# EAGLE schematic F5529LP_node (EAGLE 7.2.0)

## Sheet 1 of 2
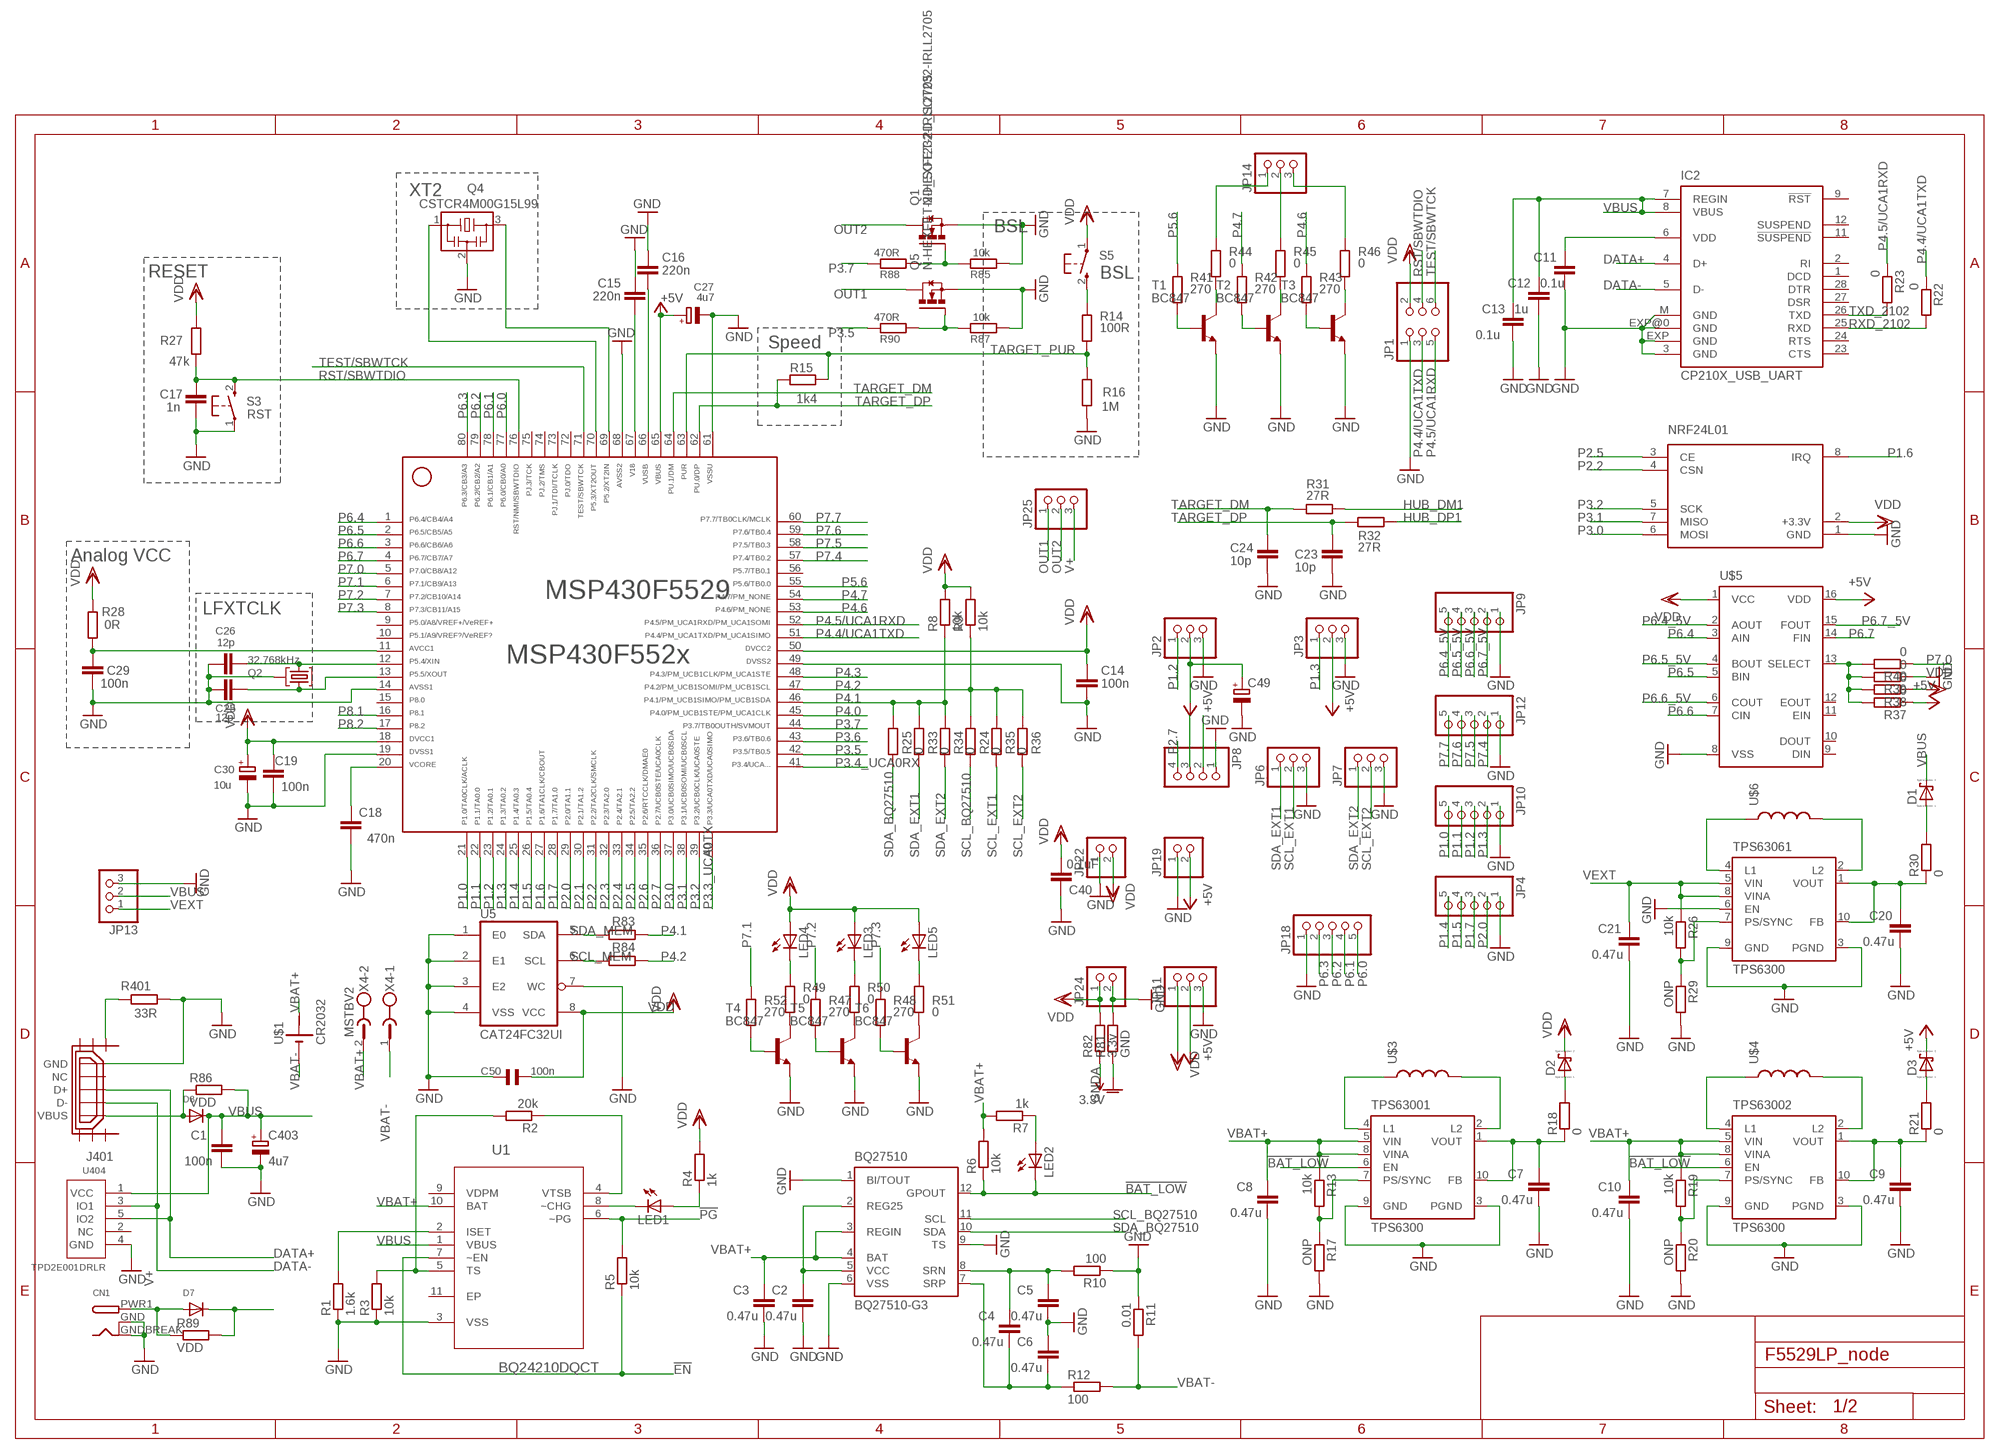
[diagram p0: schematic, sheet 1]

### Parts
BQ27510  BQ27510-G3  [DRZ]
C1  100n  C-EUC0603  [C0603]
C2  0.47u  C-EUC0603  [C0603]
C3  0.47u  C-EUC0603  [C0603]
C4  0.47u  C-EUC0603  [C0603]
C5  0.47u  C-EUC0603  [C0603]
C6  0.47u  C-EUC0603  [C0603]
C7  0.47u  C-EUC0603  [C0603]
C8  0.47u  C-EUC0603  [C0603]
C9  0.47u  C-EUC0603  [C0603]
C10  0.47u  C-EUC0603  [C0603]
C11  0.1u  C-EUC0603  [C0603]
C12  1u  C-EUC0603  [C0603]
C13  0.1u  C-EUC0603  [C0603]
C14  100n  C-EUC0603  [C0603]
C15  220n  C-EUC0603  [C0603]
C16  220n  C-EUC0603  [C0603]
C17  1n  C-EUC0603  [C0603]
C18  470n  C-EUC0603  [C0603]
C19  100n  C-EUC0603  [C0603]
C20  0.47u  C-EUC0603  [C0603]
C21  0.47u  C-EUC0603  [C0603]
C23  10p  C-EUC0603  [C0603]
C24  10p  C-EUC0603  [C0603]
C25  12p  C-EUC0603  [C0603]
C26  12p  C-EUC0603  [C0603]
C27  4u7  CPOL-EUA/3216-18R  [A/3216-18R]
C29  100n  C-EUC0603  [C0603]
C30  10u  CPOL-EUA/3216-18R  [A/3216-18R]
C40  0.1uF  C-EUC0603  [C0603]
C49  CPOL-EUF  [PANASONIC_F]
C50  100n  C_SMD0402  [0402]
C403  4u7  CPOL-EUA/3216-18R  [A/3216-18R]
CN1  DCBARRELSMT  [DCJACK_2MM_SMT]
D1  SCHOTTKY-DIODE  [DIODE_SMB]
D2  SCHOTTKY-DIODE  [DIODE_SMB]
D3  SCHOTTKY-DIODE  [DIODE_SMB]
D7  DIODESOT23_REFLOW  [SOT23-R]
D8  DIODESOT23_REFLOW  [SOT23-R]
IC2  CP210X_USB_UART  [MLP28]
J401  USB_MICRO_FLIPPED  [HIROSE-ZX62R-B-5P]
JP1  PINHD-2X3  [2X03]
JP2  PINHD-1X3  [1X03]
JP3  PINHD-1X3  [1X03]
JP4  PINHD-1X5_2.00  [1X05M]
JP6  PINHD-1X3_2.00  [1X03M]
JP7  PINHD-1X3_2.00  [1X03M]
JP8  PINHD-1X4_2.00  [1X04M]
JP9  PINHD-1X5_2.00  [1X05M]
JP10  PINHD-1X5_2.00  [1X05M]
JP11  PINHD-1X3_2.00  [1X03M]
JP12  PINHD-1X5_2.00  [1X05M]
JP13  PINHD-1X3_2.00  [1X03M]
JP14  PINHD-1X3_2.00  [1X03M]
JP18  PINHD-1X5_2.00  [1X05M]
JP19  PINHD-1X2_2.00  [1X02M]
JP22  PINHD-1X2_2.00  [1X02M]
JP24  PINHD-1X2_2.00  [1X02M]
JP25  PINHD-1X3  [1X03]
LED1  LEDSML0805  [SML0805]
LED2  LEDSML0805  [SML0805]
LED3  LEDSML0805  [SML0805]
LED4  LEDSML0805  [SML0805]
LED5  LEDSML0805  [SML0805]
MSP430F5529  MSP430F5529IPNR  F552X---PN80  [PN80]
NRF24L01  NRF24L01HP  [NRF24L01_HP]
Q1  N-HEXFET-2D_SOT232-IRLL2705  [SOT223]
Q2  32.768kHz  MS3V-T1R  [MS3V-T1R]
Q4  CSTCR4M00G15L99  MURATA-FILTER_CSTCR6M00G53Z  [MURATA-FILTER_CSTCR]
Q5  N-HEXFET-2D_SOT232-IRLL2705  [SOT223]
R1  1.6k  R-EU_R0603  [R0603]
R2  20k  R-EU_R0603  [R0603]
R3  10k  R-EU_R0603  [R0603]
R4  1k  R-EU_R0603  [R0603]
R5  10k  R-EU_R0603  [R0603]
R6  10k  R-EU_R0603  [R0603]
R7  1k  R-EU_R0603  [R0603]
R8  10k  R-EU_R0603  [R0603]
R9  10k  R-EU_R0603  [R0603]
R10  100  R-EU_R0603  [R0603]
R11  0.01  R-EU_R0603  [R0603]
R12  100  R-EU_R0603  [R0603]
R13  10k  R-EU_R0603  [R0603]
R14  100R  R-EU_R0603  [R0603]
R15  1k4  R-EU_R0603  [R0603]
R16  1M  R-EU_R0603  [R0603]
R17  ONP  R-EU_R0603  [R0603]
R18  0  R-EU_R0603  [R0603]
R19  10k  R-EU_R0603  [R0603]
R20  ONP  R-EU_R0603  [R0603]
R21  0  R-EU_R0603  [R0603]
R22  0  R-EU_R0603  [R0603]
R23  0  R-EU_R0603  [R0603]
R24  0  R-EU_R0201  [R0201]
R25  0  R-EU_R0201  [R0201]
R26  10k  R-EU_R0603  [R0603]
R27  47k  R-EU_R0603  [R0603]
R28  0R  R-EU_R0603  [R0603]
R29  ONP  R-EU_R0603  [R0603]
R30  0  R-EU_R0603  [R0603]
R31  27R  R-EU_R0603  [R0603]
R32  27R  R-EU_R0603  [R0603]
R33  0  R-EU_R0201  [R0201]
R34  0  R-EU_R0201  [R0201]
R35  0  R-EU_R0201  [R0201]
R36  0  R-EU_R0201  [R0201]
R37  0  R-EU_R0603  [R0603]
R38  0  R-EU_R0603  [R0603]
R39  0  R-EU_R0603  [R0603]
R40  0  R-EU_R0603  [R0603]
R41  270  R-EU_R0603  [R0603]
R42  270  R-EU_R0603  [R0603]
R43  270  R-EU_R0603  [R0603]
R44  0  R-EU_R0603  [R0603]
R45  0  R-EU_R0603  [R0603]
R46  0  R-EU_R0603  [R0603]
R47  270  R-EU_R0603  [R0603]
R48  270  R-EU_R0603  [R0603]
R49  0  R-EU_R0603  [R0603]
R50  0  R-EU_R0603  [R0603]
R51  0  R-EU_R0603  [R0603]
R52  270  R-EU_R0603  [R0603]
R81  GND  R-EU_R0402  [R0402]
R82  3.3v  R-EU_R0402  [R0402]
R83  0  R-EU_R0201  [R0201]
R84  0  R-EU_R0201  [R0201]
R85  10k  R_SMDR0603  [0603]
R86  VDD  R-EU_R0201  [R0201]
R87  10k  R_SMDR0603  [0603]
R88  470R  R_SMDR0603  [0603]
R89  VDD  R-EU_R0201  [R0201]
R90  470R  R_SMDR0603  [0603]
R401  33R  R-EU_R0603  [R0603]
S3  RST  PB  [PBTH]
S5  BSL  PB  [PBTH]
T1  BC847  [SOT23]
T2  BC847  [SOT23]
T3  BC847  [SOT23]
T4  BC847  [SOT23]
T5  BC847  [SOT23]
T6  BC847  [SOT23]
TPS63001  TPS6300  [DRC-S-PVSON-N10]
TPS63002  TPS6300  [DRC-S-PVSON-N10]
TPS63061  TPS6300  [DRC-S-PVSON-N10]
U1  BQ24210DQCT  [SON50P200X300X80-11N]
U5  CAT24FC32UI  M24XXX  [TSSOP8]
U404  TPD2E001DRLR  TPD2E001  [TPD2E001-DRL]
U$1  CR2032  [CR2032]
U$3  INDUCTOR-B82462G  [B82462G]
U$4  INDUCTOR-B82462G  [B82462G]
U$5  CD4504B  [SOIC16]
U$6  INDUCTOR-B82462G  [B82462G]
X4  MSTBV2  [MSTBV2]

### Nets
3.3V: R82.1 ; also sheet 2
!BAT_LOW: BQ27510.12(GPOUT) LED2.C R6.1 TPS63001.6(EN) TPS63002.6(EN)
!EN: R5.1 U1.7(~EN)
!PG: R5.2 U1.6(~PG)
+5V [Power]: C27.+ C49.+ D3.C(A) JP2.2 JP3.2 JP11.2 JP19.2 MSP430F5529.65 R37.1 U$5.16(VDD) ; also sheet 2
AVCC [Power]: C29.1 MSP430F5529.11 R28.1
DATA+: IC2.4(D+) J401.D+ U404.5(IO2)
DATA-: IC2.5(D-) J401.D- U404.3(IO1)
GND [Ground]: BQ27510.1(BI/TOUT) BQ27510.6(VSS) BQ27510.9(TS) C1.2 C2.2 C3.2 C5.2 C6.1 C7.2 C8.2 C9.2 C10.2 C11.2 C12.2 C13.2 C14.2 C15.2 C16.2 C17.2 C18.1 C19.1 C20.2 C21.2 C23.2 C24.2 C25.1 C26.1 C27.- C29.2 C30.- C40.1 C49.- C50.2 C403.- CN1.GND(GNDBREAK) CN1.GNDBREAK(GND) IC2.3(GND) IC2.EXP(GND) IC2.EXP@0(GND) IC2.M(GND) J401.GND JP1.1 JP2.3 JP3.3 JP4.1 JP6.3 JP7.3 JP8.1 JP9.1 JP10.1 JP11.3 JP12.1 JP13.3 JP18.1 JP19.1 JP22.1 JP24.2 MSP430F5529.14 MSP430F5529.19 MSP430F5529.49 MSP430F5529.61 MSP430F5529.68 NRF24L01.1(GND) Q1.3(S) Q2.P3(GND) Q4.2 Q5.3(S) R1.1 R3.1 R10.1 R11.1 R16.1 R17.2 R20.2 R29.2 R39.1 R81.2 R85.1 R87.1 R401.2 S3.1(P) T1.2(E) T2.2(E) T3.2(E) T4.2(E) T5.2(E) T6.2(E) TPS63001.3(PGND) TPS63001.9(GND) TPS63002.3(PGND) TPS63002.9(GND) TPS63061.3(PGND) TPS63061.6(EN) TPS63061.9(GND) U1.3(VSS) U5.1(E0) U5.2(E1) U5.3(E2) U5.4(VSS) U5.7(WC) U404.4(GND) U$5.8(VSS) ; also sheet 2
GNDA: R81.1 ; also sheet 2
HUB_DM1: R31.1
HUB_DP1: R32.1
N$1: R1.2 U1.2(ISET)
N$2: R2.1 U1.4(VTSB)
N$3: R2.2 R3.2 U1.5(TS)
N$4: R14.1 S5.2(S)
N$5: LED1.C U1.8(~CHG)
N$6: LED1.A R4.1
N$7: BQ27510.2(REG25) BQ27510.5(VCC) C2.1
N$8: TPS63002.4(L1) U$4.P$1
N$9: LED2.A R7.1
N$10: J401.SHIELD1 R401.1
N$11: BQ27510.8(SRN) C4.1 C5.1 R10.2
N$12: TPS63001.4(L1) U$3.P$1
N$13: TPS63001.2(L2) U$3.P$2
N$14: BQ27510.7(SRP) C4.2 C6.2 R12.1
N$15: TPS63002.2(L2) U$4.P$2
N$16: R13.2 R17.1 TPS63001.7(PS/SYNC)
N$17: R19.2 R20.1 TPS63002.7(PS/SYNC)
N$18: C9.1 R21.1 TPS63002.1(VOUT) TPS63002.10(FB)
N$19: C7.1 R18.1 TPS63001.1(VOUT) TPS63001.10(FB)
N$20: C11.1 IC2.6(VDD)
N$21: TPS63061.4(L1) U$6.P$1
N$22: TPS63061.2(L2) U$6.P$2
N$23: R26.2 R29.1 TPS63061.7(PS/SYNC)
N$24: C20.1 R30.1 TPS63061.1(VOUT) TPS63061.10(FB)
N$25: R37.2 R38.2 R39.2 R40.2 U$5.13(SELECT)
N$26: R41.2 T1.1(B)
N$27: R42.2 T2.1(B)
N$28: R43.2 T3.1(B)
N$29: R46.2 T3.3(C)
N$30: JP14.1 R44.1
N$31: JP14.2 R45.1
N$32: JP14.3 R46.1
N$33: R44.2 T1.3(C)
N$34: R45.2 T2.3(C)
N$35: D1.A(C) R30.2
N$36: D2.A(C) R18.2
N$37: D3.A(C) R21.2
N$38: R47.2 T5.1(B)
N$39: R48.2 T6.1(B)
N$40: R51.2 T6.3(C)
N$41: LED4.C R49.1
N$42: LED3.C R50.1
N$43: LED5.C R51.1
N$44: R49.2 T4.3(C)
N$45: R50.2 T5.3(C)
N$46: R52.2 T4.1(B)
N$84: Q1.1(G) R85.2 R88.1
N$85 [Power]: D8.1(A) J401.VBUS R86.1
N$86: Q5.1(G) R87.2 R90.1
OUT1: JP25.1 Q5.2(D) Q5.4(D)
OUT2: JP25.2 Q1.2(D) Q1.4(D)
P1.0: JP10.5 MSP430F5529.21
P1.1: JP10.4 MSP430F5529.22
P1.2: JP2.1 JP10.3 MSP430F5529.23
P1.3: JP3.1 JP10.2 MSP430F5529.24
P1.4: JP4.5 MSP430F5529.25
P1.5: JP4.4 MSP430F5529.26
P1.6: MSP430F5529.27 NRF24L01.8(IRQ)
P1.7: JP4.3 MSP430F5529.28
P2.0: JP4.2 MSP430F5529.29
P2.1: MSP430F5529.30
P2.2: MSP430F5529.31 NRF24L01.4(CSN)
P2.3: MSP430F5529.32
P2.4: MSP430F5529.33
P2.5: MSP430F5529.34 NRF24L01.3(CE)
P2.6: MSP430F5529.35
P2.7: JP8.4 MSP430F5529.36 ; also sheet 2
P3.0: MSP430F5529.37 NRF24L01.6(MOSI)
P3.1: MSP430F5529.38 NRF24L01.7(MISO)
P3.2: MSP430F5529.39 NRF24L01.5(SCK)
P3.3_UCA0TX: JP8.2 MSP430F5529.40 ; also sheet 2
P3.4_UCA0RX: JP8.3 MSP430F5529.41 ; also sheet 2
P3.5: MSP430F5529.42 R90.2
P3.6: MSP430F5529.43
P3.7: MSP430F5529.44 R88.2
P4.0: MSP430F5529.45
P4.1: MSP430F5529.46 R8.1 R25.1 R33.1 R34.1 R83.2
P4.2: MSP430F5529.47 R9.1 R24.1 R35.1 R36.1 R84.2
P4.3: MSP430F5529.48
P4.4/UCA1TXD: JP1.3 MSP430F5529.51 R22.1
P4.5/UCA1RXD: JP1.5 MSP430F5529.52 R23.1
P4.6: MSP430F5529.53 R43.1
P4.7: MSP430F5529.54 R42.1
P5.2/XT2IN: MSP430F5529.69 Q4.3
P5.3/XT2OUT: MSP430F5529.70 Q4.1
P5.4/XIN: C26.2 MSP430F5529.12 Q2.P2
P5.5/XOUT: C25.2 MSP430F5529.13 Q2.P1
P5.6: MSP430F5529.55 R41.1
P6.0: JP18.5 MSP430F5529.77
P6.1: JP18.4 MSP430F5529.78
P6.2: JP18.3 MSP430F5529.79
P6.3: JP18.2 MSP430F5529.80
P6.4: MSP430F5529.1 U$5.3(AIN)
P6.4_5V: JP9.5 U$5.2(AOUT)
P6.5: MSP430F5529.2 U$5.5(BIN)
P6.5_5V: JP9.4 U$5.4(BOUT)
P6.6: MSP430F5529.3 U$5.7(CIN)
P6.6_5V: JP9.3 U$5.6(COUT)
P6.7: MSP430F5529.4 U$5.14(FIN)
P6.7_5V: JP9.2 U$5.15(FOUT)
P7.0: MSP430F5529.5 R40.1
P7.1: MSP430F5529.6 R52.1
P7.2: MSP430F5529.7 R47.1
P7.3: MSP430F5529.8 R48.1
P7.4: JP12.2 MSP430F5529.57
P7.5: JP12.3 MSP430F5529.58
P7.6: JP12.4 MSP430F5529.59
P7.7: JP12.5 MSP430F5529.60
P8.1: MSP430F5529.16
P8.2: MSP430F5529.17
RST/SBWTDIO: C17.1 JP1.4 MSP430F5529.76 R27.1 S3.2(S)
RXD_2102: IC2.25(RXD) R22.2
SCL_BQ27510: BQ27510.11(SCL) R24.2
SCL_EXT1: JP6.2 R35.2
SCL_EXT2: JP7.2 R36.2
SCL_MEM: R84.1 U5.6(SCL)
SDA_BQ27510: BQ27510.10(SDA) R25.2
SDA_EXT1: JP6.1 R33.2
SDA_EXT2: JP7.1 R34.2
SDA_MEM: R83.1 U5.5(SDA)
TARGET_DM: C24.1 MSP430F5529.64 R31.2
TARGET_DP: C23.1 MSP430F5529.62 R15.2 R32.2
TARGET_PUR: MSP430F5529.63 R14.2 R15.1 R16.2
TARGET_VUSB [Power]: C16.1 MSP430F5529.66
TEST/SBWTCK: JP1.6 MSP430F5529.71
TXD_2102: IC2.26(TXD) R23.2
V18 [Power]: C15.1 MSP430F5529.67
V+: CN1.PWR1(PWR) D7.1(A) JP25.3 R89.1
VBAT+: BQ27510.3(REGIN) BQ27510.4(BAT) C3.1 C8.1 C10.1 R6.2 R7.2 R13.1 R19.1 TPS63001.5(VIN) TPS63001.8(VINA) TPS63002.5(VIN) TPS63002.8(VINA) U1.10(BAT) U$1.P$1(+) X4.2
VBAT-: R11.2 R12.2 U$1.P$2(-) X4.1
VBUS [Power]: C1.1 C12.1 C13.1 C403.+ D1.C(A) D7.3(C) D8.3(C) IC2.7(REGIN) IC2.8(VBUS) JP13.2 R86.2 R89.2 U1.1(VBUS) U404.1(VCC)
VCORE [Power]: C18.2 MSP430F5529.20
VDD: C14.1 C19.2 C30.+ C40.2 C50.1 D2.C(A) JP1.2 JP11.1 JP22.2 JP24.1 LED3.A LED4.A LED5.A MSP430F5529.18 MSP430F5529.50 NRF24L01.2(+3.3V) R4.2 R8.2 R9.2 R27.2 R28.2 R38.1 R82.2 S5.1(P) U5.8(VCC) U$5.1(VCC) ; also sheet 2
VEXT: C21.1 JP13.1 R26.1 TPS63061.5(VIN) TPS63061.8(VINA)
Unconnected: IC2.1(DCD) IC2.2(RI) IC2.9(!RST) IC2.11(!SUSPEND) IC2.12(SUSPEND) IC2.23(CTS) IC2.24(RTS) IC2.27(DSR) IC2.28(DTR) J401.NC J401.SHIELD2 J401.SHIELD3 J401.SHIELD4 J401.SHIELD5 J401.SHIELD6 MSP430F5529.9 MSP430F5529.10 MSP430F5529.15 MSP430F5529.56 MSP430F5529.72 MSP430F5529.73 MSP430F5529.74 MSP430F5529.75 TPS63001.TH TPS63002.TH TPS63061.TH U1.9(VDPM) U1.11(EP) U404.2(NC) U$5.9(DIN) U$5.10(DOUT) U$5.11(EIN) U$5.12(EOUT)

### Notes on the sheet
- XT2
- BSL
- RESET
- Speed
- Analog VCC
- LFXTCLK

## Sheet 2 of 2
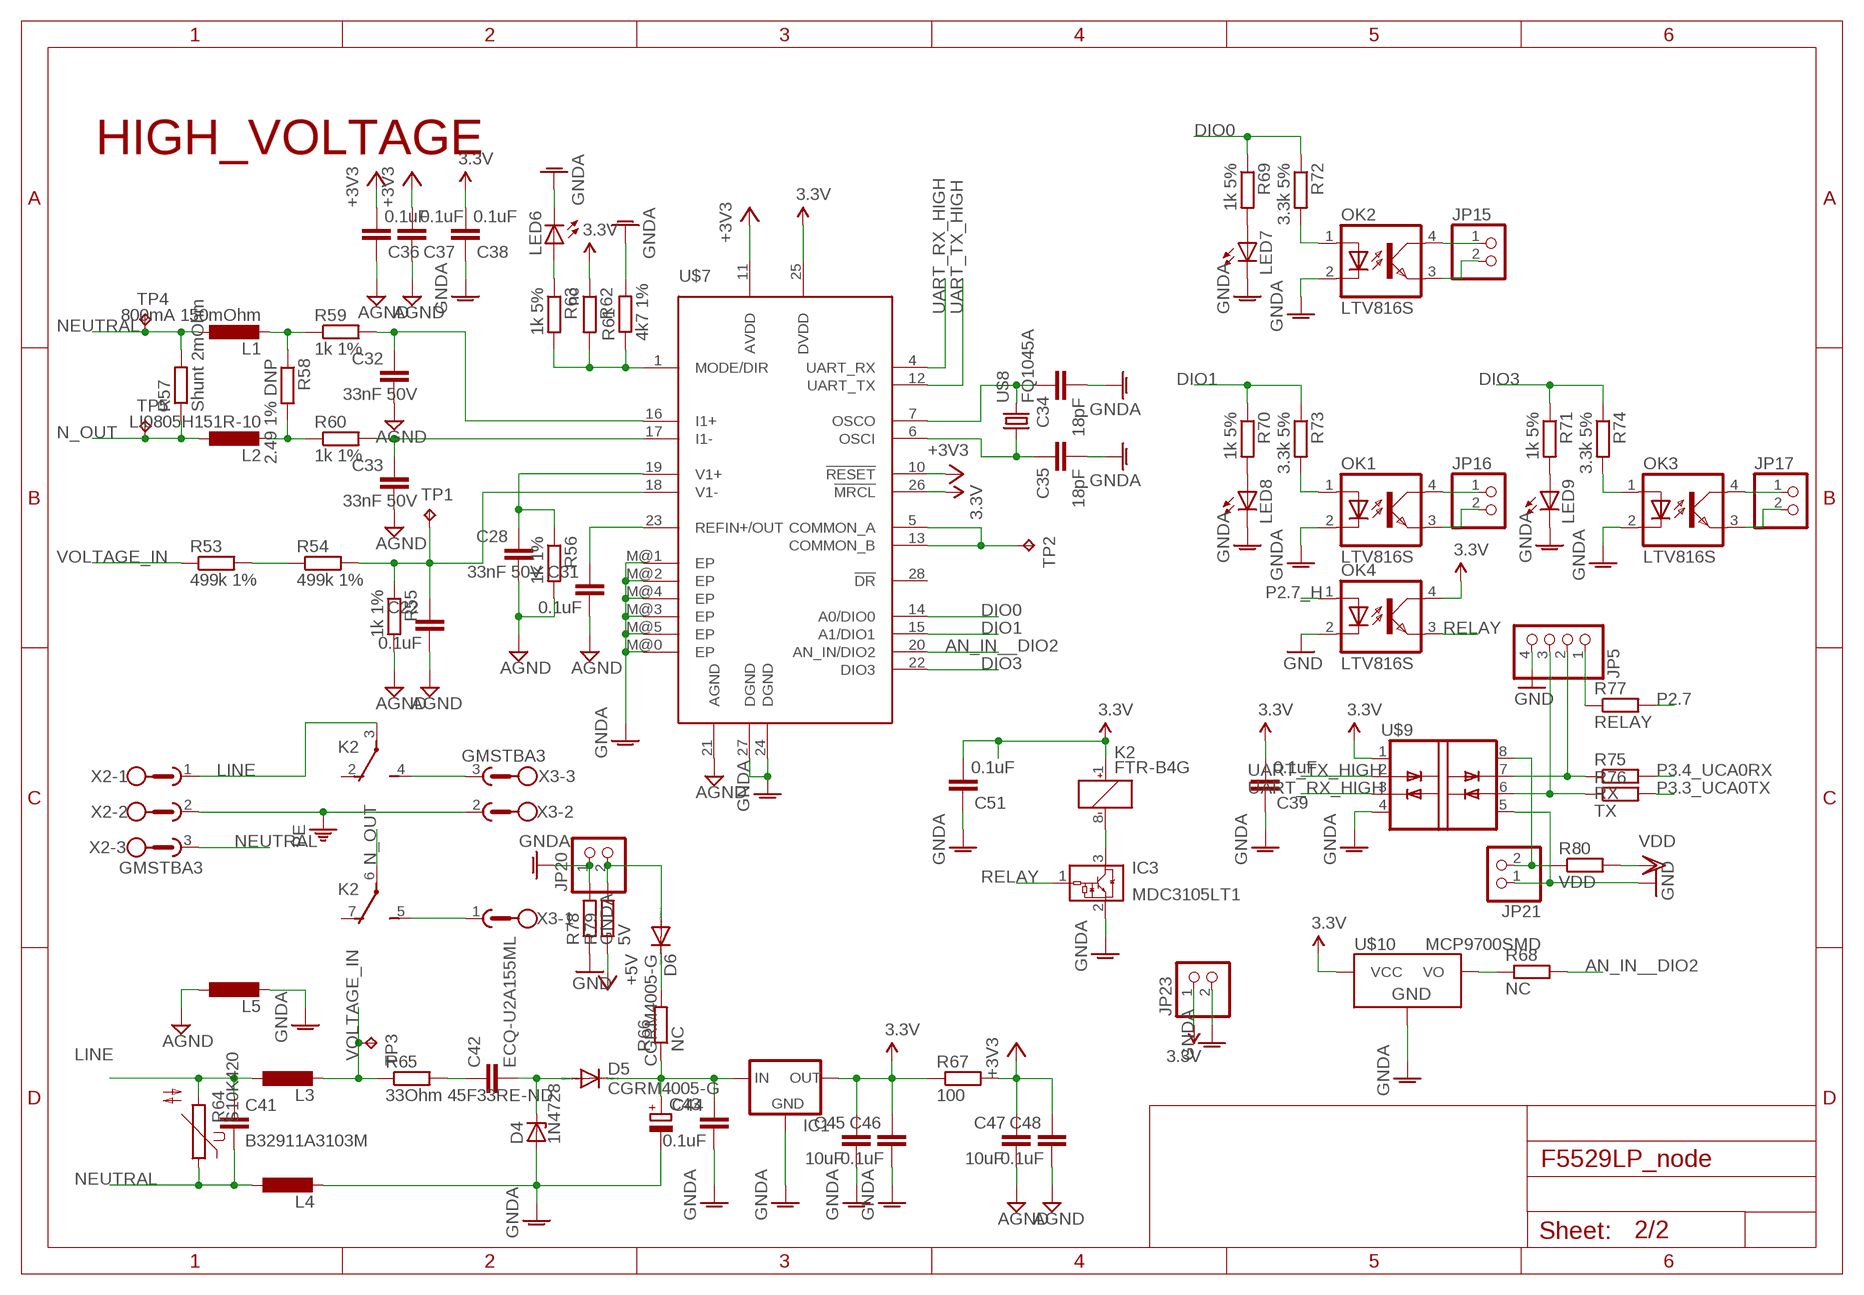
[diagram p1: schematic, sheet 2]

### Parts
C22  0.1uF  C-EUC0603  [C0603]
C28  33nF 50V  C-EUC0603  [C0603]
C31  0.1uF  C-EUC0603  [C0603]
C32  33nF 50V  C-EUC0603  [C0603]
C33  33nF 50V  C-EUC0603  [C0603]
C34  18pF  C-EUC0603  [C0603]
C35  18pF  C-EUC0603  [C0603]
C36  0.1uF  C-EUC0603  [C0603]
C37  0.1uF  C-EUC0603  [C0603]
C38  0.1uF  C-EUC0603  [C0603]
C39  0.1uF  C-EUC0603  [C0603]
C41  B32911A3103M  C-EU075-042X103  [C075-042X103]
C42  ECQ-U2A155ML  C-EU275-173X316  [C275-173X316]
C43  CPOL-EUF  [PANASONIC_F]
C44  0.1uF  C-EUC0603  [C0603]
C45  10uF  C-EUC1206  [C1206]
C46  0.1uF  C-EUC0603  [C0603]
C47  10uF  C-EUC1206  [C1206]
C48  0.1uF  C-EUC0603  [C0603]
C51  0.1uF  C-EUC0805  [C0805]
D4  1N4728  [DO41Z10]
D5  CGRM4005-G  [SOD-123_MINI-SMA]
D6  CGRM4005-G  [SOD-123_MINI-SMA]
IC1  LM1117  [SOT223]
IC3  MDC3105LT1  [SOT23]
JP5  PINHD-1X4_2.00  [1X04M]
JP15  PINHD-1X2_2.00  [1X02M]
JP16  PINHD-1X2_2.00  [1X02M]
JP17  PINHD-1X2_2.00  [1X02M]
JP20  PINHD-1X2_2.00  [1X02M]
JP21  PINHD-1X2_2.00  [1X02M]
JP23  PINHD-1X2_2.00  [1X02M]
K2  FTR-B4G  [FTR-B4G]
L1  800mA 150mOhm  L-EUL2825P  [L2825P]
L2  LI0805H151R-10  L-EUL2825P  [L2825P]
L3  L-EU0207/5V  [0207/5V]
L4  L-EU0207/5V  [0207/5V]
L5  L-EUL2825P  [L2825P]
LED6  LEDCHIPLED_0805  [CHIPLED_0805]
LED7  LEDCHIPLED_0805  [CHIPLED_0805]
LED8  LEDCHIPLED_0805  [CHIPLED_0805]
LED9  LEDCHIPLED_0805  [CHIPLED_0805]
OK1  LTV816S  [SMD4]
OK2  LTV816S  [SMD4]
OK3  LTV816S  [SMD4]
OK4  LTV816S  [SMD4]
R53  499k 1%  R-EU_R2010  [R2010]
R54  499k 1%  R-EU_R2010  [R2010]
R55  1k 1%  R-EU_R0603  [R0603]
R56  1k 1%  R-EU_R0603  [R0603]
R57  Shunt 2mOhm  R-EU_R2512  [R2512]
R58  2.49 1% DNP  R-EU_R0603  [R0603]
R59  1k 1%  R-EU_R0603  [R0603]
R60  1k 1%  R-EU_R0603  [R0603]
R61  4k7 1%  R-EU_R0603  [R0603]
R62  nc  R-EU_R0603  [R0603]
R63  1k 5%  R-EU_R0603  [R0603]
R64  S10K420  [S10K420]
R65  33Ohm 45F33RE-ND  R-EU_0617/5V  [0617V]
R66  NC  R-EU_R2010  [R2010]
R67  100  R-EU_R0603  [R0603]
R68  NC  R-EU_R0603  [R0603]
R69  1k 5%  R-EU_R0603  [R0603]
R70  1k 5%  R-EU_R0603  [R0603]
R71  1k 5%  R-EU_R0603  [R0603]
R72  3.3k 5%  R-EU_R0603  [R0603]
R73  3.3k 5%  R-EU_R0603  [R0603]
R74  3.3k 5%  R-EU_R0603  [R0603]
R75  RX  R-EU_R0201  [R0201]
R76  TX  R-EU_R0201  [R0201]
R77  RELAY  R-EU_R0201  [R0201]
R78  GNDA  R-EU_R0402  [R0402]
R79  5V  R-EU_R0402  [R0402]
R80  VDD  R-EU_R0201  [R0201]
TP1  TPB2,54  [B2,54]
TP2  TPB1,27  [B1,27]
TP3  TPB2,54  [B2,54]
TP4  TPB2,54  [B2,54]
TP5  TPB2,54  [B2,54]
U$7  MCP39F501  [QFN28]
U$8  FQ1045A  [FQ1045A]
U$9  IL712  [SOIC08]
U$10  MCP9700SMD  [SOT23-3]
U$11  HIGH_VOLTAGE  [HIGH_VOLTAGE]
X2  GMSTBA3  [GMSTBA3]
X3  GMSTBA3  [GMSTBA3]

### Nets
3.3V: C38.2 C39.2 C45.1 C46.1 C51.2 IC1.2(OUT) JP23.1 K2.1(K:+) OK4.4(COL) R62.1 R67.1 U$7.25(DVDD) U$7.26(!MRCL) U$9.1(VDD1) U$10.1(VCC) ; also sheet 1
+3V3: C36.2 C37.2 C47.1 C48.1 R67.2 U$7.10(!RESET) U$7.11(AVDD)
+5V [Power]: R79.1 ; also sheet 1
AGND: C22.2 C28.2 C31.2 C32.2 C33.2 C36.1 C37.1 C47.2 C48.2 L5.1 R55.2 R56.2 U$7.21(AGND)
AN_IN__DIO2: R68.2 U$7.20(AN_IN/DIO2)
DIO0: R69.1 R72.1 U$7.14(A0/DIO0)
DIO1: R70.1 R73.1 U$7.15(A1/DIO1)
DIO3: R71.1 R74.1 U$7.22(DIO3)
GND [Ground]: JP5.4 JP21.1 OK4.2(C) R78.1 U$9.5(GND2) ; also sheet 1
GNDA: C34.2 C35.2 C38.1 C39.1 C43.- C44.2 C45.2 C46.2 C51.1 D4.A IC1.1(GND) IC3.2(GND) JP20.1 JP23.2 L4.2 L5.2 LED6.C LED7.C LED8.C LED9.C OK1.2(C) OK2.2(C) OK3.2(C) R61.2 R78.2 U$7.24(DGND) U$7.27(DGND) U$7.M@0(EP) U$7.M@1(EP) U$7.M@2(EP) U$7.M@3(EP) U$7.M@4(EP) U$7.M@5(EP) U$9.4(GND1) U$10.3(GND) ; also sheet 1
LINE: C41.1 K2.3(-1:P) L3.1 R64.2 X2.1
LINE_RELAY: K2.4(-1:S) X3.3
N$47: LED8.A R70.2
N$48: R53.2 R54.1
N$49: C22.1 R54.2 R55.1 TP1.TP U$7.18(V1-)
N$50: C28.1 R56.1 U$7.19(V1+)
N$51: C31.1 U$7.23(REFIN+/OUT)
N$52: LED7.A R69.2
N$53: LED9.A R71.2
N$54: L1.2 R58.1 R59.1
N$55: L2.2 R58.2 R60.1
N$56: C33.1 R60.2 U$7.17(I1-)
N$57: C32.1 R59.2 U$7.16(I1+)
N$58: R61.1 R62.2 R63.2 U$7.1(MODE/DIR)
N$59: LED6.A R63.1
N$60: C34.1 U$7.7(OSCO) U$8.2
N$61: C35.1 U$7.6(OSCI) U$8.1
N$62: C43.+ C44.1 D5.C IC1.3(IN) R66.1
N$63: D6.C R66.2
N$65: OK2.1(A) R72.2
N$66: TP2.TP U$7.5(COMMON_A) U$7.13(COMMON_B)
N$67: R68.1 U$10.2(VO)
N$68: C42.2 D4.C D5.A
N$69: C42.1 R65.2
N$70: OK1.1(A) R73.2
N$71: OK3.1(A) R74.2
N$72: JP5.2 R75.1 U$9.7(OUT1)
N$73: JP5.3 R76.1 U$9.6(IN2)
N$74: JP15.1 OK2.4(COL)
N$75: JP15.2 OK2.3(EMIT)
N$76: JP16.1 OK1.4(COL)
N$77: JP16.2 OK1.3(EMIT)
N$78: JP17.1 OK3.4(COL)
N$79: JP17.2 OK3.3(EMIT)
N$80: IC3.3(VOUT) K2.8(K:-)
N$81: D6.A JP20.2 R79.2
N$82: JP21.2 R80.1 U$9.8(VDD2)
N_OUT: K2.6(-2:P) L2.1 R57.1 TP5.TP
NEUTRAL: C41.2 L1.1 L4.1 R57.2 R64.1 TP4.TP X2.3
NEUTRAL_RELAY: K2.5(-2:S) X3.1
P2.7: R77.2 ; also sheet 1
P2.7_H: JP5.1 OK4.1(A) R77.1
P3.3_UCA0TX: R76.2 ; also sheet 1
P3.4_UCA0RX: R75.2 ; also sheet 1
PE: X2.2 X3.2
RELAY: IC3.1(VIN) OK4.3(EMIT)
UART_RX_HIGH: U$7.4(UART_RX) U$9.3(OUT2)
UART_TX_HIGH: U$7.12(UART_TX) U$9.2(IN1)
VDD: R80.2 ; also sheet 1
VOLTAGE_IN: L3.2 R53.1 R65.1 TP3.TP
Unconnected: K2.2(-1:O) K2.7(-2:O)

## Power pins joined to a net without a drawn wire
!DR: U$7.28(!DR)
PWPD: BQ27510.EXP@1(PWPD) BQ27510.EXP@2(PWPD) BQ27510.EXP@3(PWPD) BQ27510.EXP@4(PWPD) BQ27510.EXP@5(PWPD) BQ27510.EXP@6(PWPD) BQ27510.EXP@7(PWPD) BQ27510.EXP@8(PWPD) BQ27510.EXP@9(PWPD)

## Library data of the parts
BQ27510 = texas:BQ27510-G3
C1-C26 C28 C29 C31-C40 C44-C48 C51 = rcl:C-EU: CAPACITOR, European symbol
C27 C30 C403 = rcl:CPOL-EU: POLARIZED CAPACITOR, European symbol
C41 C42 = resistor:C-EU: CAPACITOR, European symbol
C43 C49 = resistor:CPOL-EU: POLARIZED CAPACITOR, European symbol
C50 = smd:C_SMD
CN1 = adafruit:DCBARREL: 2.0mm DC Barrel Jack DCJACK_2MM_PTH - Through Hole Jack (4UConnector: 05537)
D1-D3 = eagle-ltspice:SCHOTTKY-DIODE: Schottky Diode; SPICEMODEL: NONE; SPICEPREFIX: D; SPICETYPE: diode
D4 = diode:1N4728: Z DIODE 3.3 V, 1W, 5 percent
D5 D6 = diode:CGRM400*-G: Molded plasitc,JEDEC SOD-123/Mini SMA Source: Comchip CGRM4001-G.pdf
D7 D8 = adafruit:DIODE: Diode SMADIODE - SMA Surface Mount Package 20V 1A Schottky Diode Digikey: 641-1014-6-ND DO-1N4148 - Through Hole Small Current Diode SOD-123 20V 1 A (.5mV Vf) Schottky Diode - Digikey: MBRX120TPMSCT-ND SOD-323 10V 570mA (.38mV Vf, 3ns) Schottky Diode - Digikey: ZLLS410CT-ND SOD-523 30V 30mA Schottky Diode (RB751S-40TE61) - Digikey: RB751S-40TE61CT-ND SOT23-R/W - SOT23 Package (R = Solder Paste/Reflow Ovens, W = Hand-Soldering) BAT54Film 40V 300mA - Digikey: 497-7162-1-ND
IC1 = v-reg-2:LM1117
IC2 = SparkFun:CP210X_USB_UART: Single-Chip USB to UART Bridge Source: www.silabs.com .. CP2101.pdf / cp2102.pdf. Spark Fun Electronics SKU : COM-00310
IC3 = on-semiconductor:MDC3105LT1: Integrated Relay, Inductive Load Driver Sopurce: U6 OnSemi Inductive Load Driver MDC3105-D.PDF; MF: ON SEMICONDUCTOR; MPN: MDC3105LT1; OC_FARNELL: 1126459; OC_NEWARK: 16F6132
J401 = usb_con-update:USB_MICRO_FLIPPED
JP1 = pinhead:PINHD-2X3: PIN HEADER
JP2 JP3 JP25 = pinhead:PINHD-1X3: PIN HEADER
JP4 JP9 JP10 JP12 JP18 = pinhead_smd:PINHD-1X5: PIN HEADER
JP5 JP8 = pinhead_smd:PINHD-1X4: PIN HEADER
JP6 JP7 JP11 JP13 JP14 = pinhead_smd:PINHD-1X3: PIN HEADER
JP15-JP17 JP19-JP24 = pinhead_smd:PINHD-1X2: PIN HEADER
K2 = relay:FTR-B4: ULTRA MINIATURE RELAY 2 POLES - 2 A (Slim Profile Signal Relay) FUJITSU FTR-B4 SERIES Source: FTR-B4.pdf
L1-L5 = resistor:L-EU: INDUCTOR, European symbol
LED1-LED5 = led:LED: LED
LED6-LED9 = adafruit:LED: LED
MSP430F5529 = TI_MSP430_v16_intern:F552X---PN80: ***MSP430F552X***PN80 http://www.ti.com/lit/gpn/msp430f5529 Rev1.0 06/2010 For F552X where X is 1,5,7,9
NRF24L01 = jt-raspberry-pi:NRF24L01
OK1-OK4 = optocoupler:LTV816: OPTO COUPLER Source: LITEON, LTV816.pdf; OC_FARNELL: unknown; OC_NEWARK: unknown
Q1 Q5 = transistor-power:N-HEXFET-2D_?-*: HEXFET® Power MOSFET 2 Drain connects http://www.irf.com/product-info/datasheets/data/irll014n.pdf
Q2 = microcrystal:MS3V-T1R
Q4 = murata:MURATA-FILTER_CSTCR: Resonator Source: murata.co.jp; MPN: CSTCR6M00G53-R0; OC_FARNELL: 1170434; OC_NEWARK: 25M8759
R1-R13 R17-R23 R26 R29 R30 R37-R40 R53-R63 R65-R82 R86 R89 = resistor:R-EU_: RESISTOR, European symbol
R14-R16 R24 R25 R27 R28 R31-R36 R41-R52 R83 R84 R401 = rcl:R-EU_: RESISTOR, European symbol
R64 = varistor:S10K420: VARISTOR
R85 R87 R88 R90 = ssmd:R_SMD
S3 S5 = electricalmeter:PB: OMRON SWITCH
T1-T6 = transistor:BC847: NPN TRANSISTOR
TP1-TP5 = testpad:TP: Test pad
TPS63001 TPS63002 TPS63061 = texas:TPS6300*: HIGH EFFICIENT SINGLE INDUCTOR BUCK-BOOST CONVERTER WITH 1.8-A SWITCHES Source: http://focus.ti.com/lit/ds/symlink/tps63001.pdf; MPN: TPS63000DRCTG4; OC_FARNELL: 1511852; OC_NEWARK: 59M7217
U1 = texas:BQ24210DQCT: Single Cell Li-Ion Battery Solar Charger; MPN: BQ24210DQCT; OC_FARNELL: 1903633; OC_NEWARK: 56T0491; PACKAGE: SON-10; SUPPLIER: TEXAS INSTRUMENTS
U5 = usbfet:M24XXX: Serial EEProm: 24LC xxx
U404 = Project7264:TPD2E001: TPD2E001 ESD-protection diode array
U$1 = jt-raspberry-pi:CR2032
U$3 U$4 U$6 = SparkFun:INDUCTOR: Inductors Basic Inductor/Choke - 0603 and 1206. Footprints are not proven and vary greatly between part numbers.
U$5 = IAL_Library:CD4504B
U$7 = jt-raspberry-pi:MCP39F501
U$8 = jt-raspberry-pi:FQ1045A
U$9 = jt-raspberry-pi:IL712
U$10 = SparkFun:MCP9700
U$11 = jt-raspberry-pi:HIGH_VOLTAGE
X2 X3 = con-phoenix-762:GMSTBA3: PHOENIX; MF: FARNELL; MPN: 1757255; OC_FARNELL: 3705183; OC_NEWARK: 71C4162
X4 = con-phoenix-508:MSTBV2: PHOENIX; MPN: MSTBV 2,5/2-GF-5.08; OC_FARNELL: 1792792; OC_NEWARK: 69R9845

## Net classes
0 default: width 0.254 mm
1 Ground: width 0.1 mm, drill 0.2 mm
2 Power: width 0.203 mm, drill 0.305 mm, clearance 0.152 mm to class 0, clearance 0.152 mm to class 1, clearance 0.152 mm